# EAGLE design a917-stereo-split (EAGLE 7.6.0)
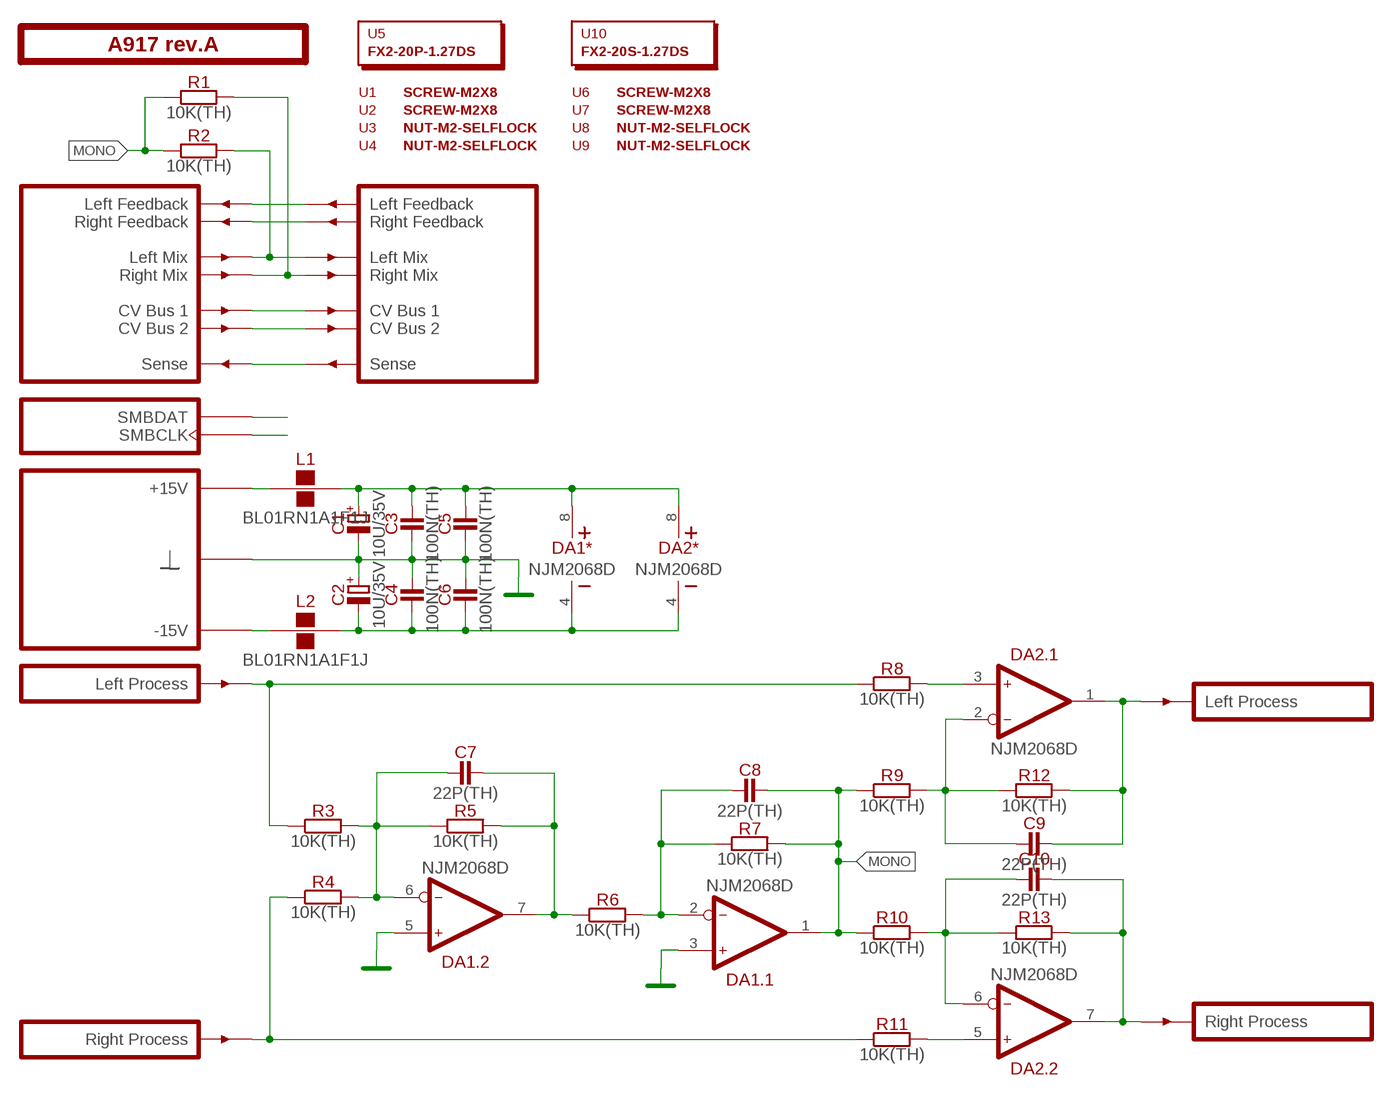
[diagram p0: schematic, sheet 1]

## Parts
C1  10U/35V  [E2-5]
C2  10U/35V  [E2-5]
C3  100N(TH)  [C050-024X044]
C4  100N(TH)  [C050-024X044]
C5  100N(TH)  [C050-024X044]
C6  100N(TH)  [C050-024X044]
C7  22P(TH)  [C050-024X044]
C8  22P(TH)  [C050-024X044]
C9  22P(TH)  [C050-024X044]
C10  22P(TH)  [C050-024X044]
DA1  NJM2068D  [DIP-8]
DA2  NJM2068D  [DIP-8]
L1  BL01RN1A1F1J  [BL01RN1A]
L2  BL01RN1A1F1J  [BL01RN1A]
PCB1  A917 rev.A  ST2-BOARD-26  [ST2-BOARD-26]
R1  10K(TH)  [R-0207/10]
R2  10K(TH)  [R-0207/10]
R3  10K(TH)  [R-0207/10]
R4  10K(TH)  [R-0207/10]
R5  10K(TH)  [R-0207/10]
R6  10K(TH)  [R-0207/10]
R7  10K(TH)  [R-0207/10]
R8  10K(TH)  [R-0207/10]
R9  10K(TH)  [R-0207/10]
R10  10K(TH)  [R-0207/10]
R11  10K(TH)  [R-0207/10]
R12  10K(TH)  [R-0207/10]
R13  10K(TH)  [R-0207/10]
U1  SCREW-M2X8  [EMPTY]
U2  SCREW-M2X8  [EMPTY]
U3  NUT-M2-SELFLOCK  [EMPTY]
U4  NUT-M2-SELFLOCK  [EMPTY]
U5  FX2-20P-1.27DS  [EMPTY]
U6  SCREW-M2X8  [EMPTY]
U7  SCREW-M2X8  [EMPTY]
U8  NUT-M2-SELFLOCK  [EMPTY]
U9  NUT-M2-SELFLOCK  [EMPTY]
U10  FX2-20S-1.27DS  [EMPTY]

## Nets
GND: C1.- C2.+ C3.1 C4.2 C5.1 C6.2 DA1.3(.1:IN+) DA1.5(.2:IN+) PCB1.B4'(GND) PCB1.B4(GND) PCB1.B5'(GND) PCB1.B5(GND) PCB1.B6'(GND) PCB1.B6(GND) PCB1.B7'(GND) PCB1.B7(GND) PCB1.B8'(GND) PCB1.B8(GND)
MONO: C8.2 DA1.1(.1:OUT) R1.1 R2.1 R7.2 R9.1 R10.1
N$1: PCB1.ALFBK'(LFBK') PCB1.ALFBK(LFBK)
N$2: PCB1.ARFBK'(RFBK') PCB1.ARFBK(RFBK)
N$3: PCB1.ALMIX'(LMIX') PCB1.ALMIX(LMIX) R2.2
N$4: PCB1.ARMIX'(RMIX') PCB1.ARMIX(RMIX) R1.2
N$5: PCB1.ACV1'(CV1') PCB1.ACV1(CV1)
N$6: PCB1.ACV2'(CV2') PCB1.ACV2(CV2)
N$7: PCB1.BSENSE'(SENSE') PCB1.BSENSE(SENSE)
N$8: PCB1.ASMBDAT'(SMBDAT) PCB1.ASMBDAT(SMBDAT)
N$9: PCB1.ASMBCLK'(SMBCLK) PCB1.ASMBCLK(SMBCLK)
N$10: C7.1 DA1.6(.2:IN-) R3.2 R4.2 R5.1
N$11: C7.2 DA1.7(.2:OUT) R5.2 R6.1
N$12: C8.1 DA1.2(.1:IN-) R6.2 R7.1
N$14: DA2.3(.1:IN+) R8.2
N$15: C9.1 DA2.2(.1:IN-) R9.2 R12.1
N$16: C9.2 DA2.1(.1:OUT) PCB1.BOUTL'(OUTL) R12.2
N$17: DA2.5(.2:IN+) R11.2
N$18: C10.1 DA2.6(.2:IN-) R10.2 R13.1
N$19: C10.2 DA2.7(.2:OUT) PCB1.BOUTR'(OUTR) R13.2
N$20: PCB1.BINL(INL) R3.1 R8.1
N$22: PCB1.BINR(INR) R4.1 R11.1
N$25: L1.1 PCB1.A+15'(P+15V) PCB1.A+15(P+15V) PCB1.B+15'(P+15V) PCB1.B+15(P+15V)
N$45: C1.+ C3.2 C5.2 DA1.8(*:V+) DA2.8(*:V+) L1.2
N$46: L2.1 PCB1.A-15'(P-15V) PCB1.A-15(P-15V) PCB1.B-15'(P-15V) PCB1.B-15(P-15V)
N$47: C2.- C4.1 C6.1 DA1.4(*:V-) DA2.4(*:V-) L2.2

## Library data of the parts
C1 C2 = capacitors-electrolytic:?; MOUSER: 647-USW1V100MDD
C3-C6 = capacitors:?; MOUSER: 81-RCER71H104K0A2H3B
C7-C10 = capacitors:?
DA1 DA2 = ic-jrc:NJM2068; MOUSER: 513-NJM2068D
L1 L2 = inductors:BL01RN1A?; MOUSER: 81-BL01RN1A1F1J
PCB1 = module-footprints:ST2-BOARD-?
R1-R13 = resistors:?; MOUSER: 71-RN55D-F-10K
U1-U4 U6-U9 = hardware:*?
U5 = hardware:?; MOUSER: 798-FX2-20P-1.27DS71
U10 = hardware:?; MOUSER: 798-FX2-20S-1.27DS71

## Board
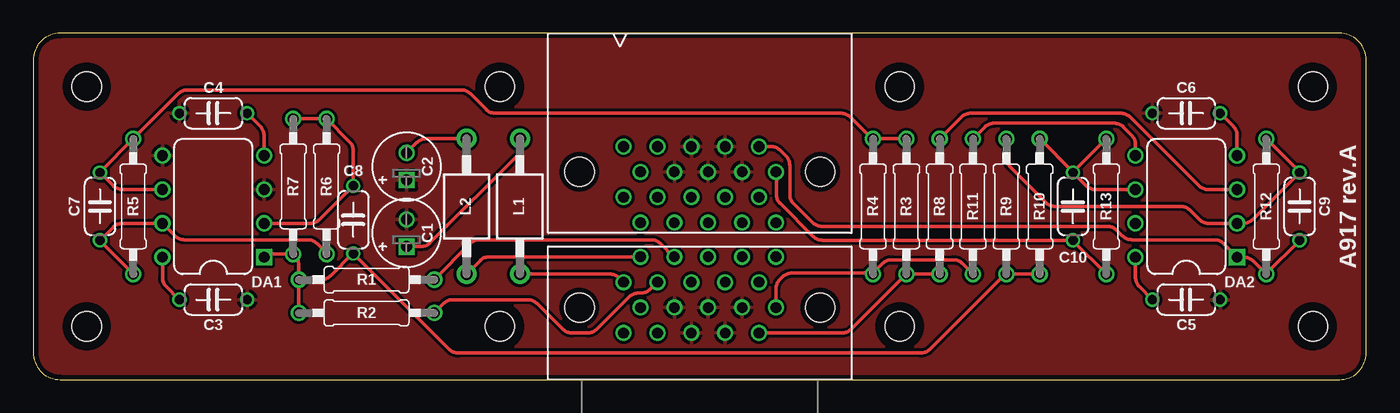
[diagram p1: board, top side]
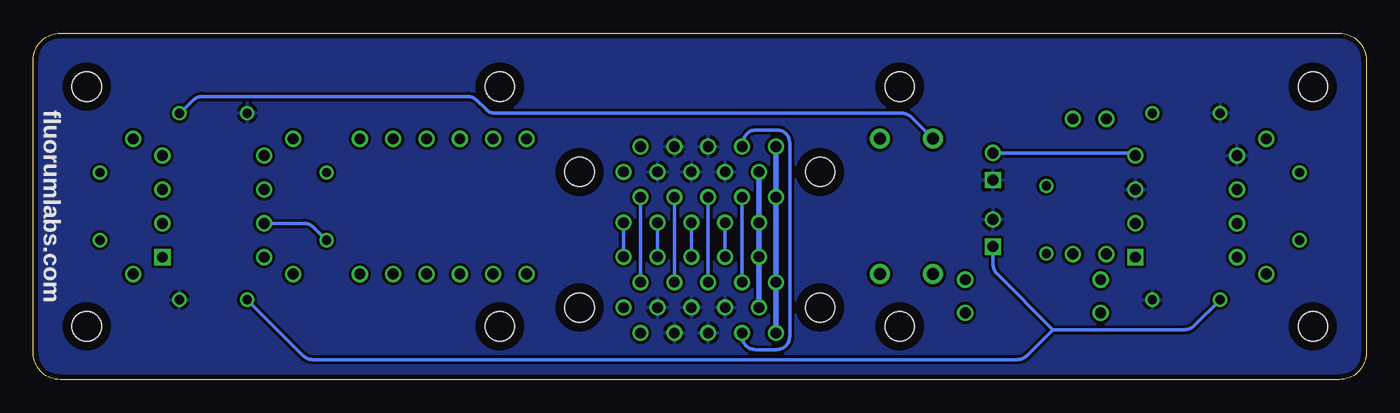
[diagram p2: board, bottom side, seen from below]

Size 100 x 26 mm. Coordinates in mm from the lower left corner, seen from the top.
Outline: 0,24 0,2 arc90 2,0 98,0 arc90 100,2 100,24 arc90 98,26 2,26 arc90 0,24
Copper layers (1*16): Top 0.0356mm / dielectric 1.5011mm / Bottom 0.0356mm
Design rules "sonictrain": minimum track width 6mil, minimum drill 13mil, track to track 8mil, track to pad 8mil, pad to pad 6mil, via to via 6mil, smd to smd 6mil, copper to edge 15mil, drill to drill 6mil, minimum pad ring 7mil, minimum via ring 7mil, stop-mask expansion 3mil, vias tented up to drill 25mil, thermal gap 10mil

### Footprints (pad centres in the part's own frame; a part is rotated, then mirrored left to right if it is on the bottom)
E2-5 = drill 0.813 square: + -1.016,0 | drill 0.813: - 1.016,0
C050-024X044 = drill 0.7: 1 -2.54,0; 2 2.54,0
DIP-8 = drill 0.813 square: 1 -3.81,-3.81 | drill 0.813: 2 -1.27,-3.81; 3 1.27,-3.81; 4 3.81,-3.81; 5 3.81,3.81; 6 1.27,3.81; 7 -1.27,3.81; 8 -3.81,3.81
BL01RN1A = drill 0.9 pad 1.5: 1 -5.08,0; 2 5.08,0
ST2-BOARD-26 = drill 0.8: A+15 44.285,7.31; A+15' 44.285,13.69; A-15 45.555,9.215; A-15' 45.555,11.785; ACV1 51.905,7.31; ACV1' 51.905,13.69; ACV2 53.175,9.215; ACV2' 53.175,11.785; ALFBK 49.365,7.31; ALFBK' 49.365,13.69; ALMIX 46.825,7.31; ALMIX' 46.825,13.69; ARFBK 50.635,9.215; ARFBK' 50.635,11.785; ARMIX 48.095,9.215; ARMIX' 48.095,11.785; ASMBCLK 55.715,9.215; ASMBCLK' 55.715,11.785; ASMBDAT 54.445,7.31; ASMBDAT' 54.445,13.69; B4 48.095,5.405; B4' 48.095,15.595; B5 49.365,3.5; B5' 49.365,17.5; B6 50.635,5.405; B6' 50.635,15.595; B7 51.905,3.5; B7' 51.905,17.5; B8 53.175,5.405; B8' 53.175,15.595; B+15 44.285,3.5; B+15' 44.285,17.5; B-15 45.555,5.405; B-15' 45.555,15.595; BINL 54.445,3.5; BINR 55.715,5.405; BOUTL' 54.445,17.5; BOUTR' 55.715,15.595; BSENSE 46.825,3.5; BSENSE' 46.825,17.5 | hole 2.2: 4,4; 4,22; 96,4; 96,22; 35,22; 65,22; 65,4; 35,4; 59.025,5.405; 40.975,5.405; 40.975,15.595; 59.025,15.595
R-0207/10 = drill 0.813: 1 -5.08,0; 2 5.08,0

### Placement (x,y rotation side)
C1  28,11 90 top
C2  28,16 90 top
C3  13.5,6 180 top
C4  13.5,20 180 top
C5  86.5,6 180 top
C6  86.5,20 180 top
C7  5,13 270 top
C8  24,12 270 top
C9  95,13 270 top
C10  78,13 270 top
DA1  13.5,13 90 top
DA2  86.5,13 90 top
L1  36.5,13 90 top
L2  32.5,13 90 top
PCB1  0,0 0 top
R1  25,7.5 0 top
R2  25,5 0 top
R3  65.5,13 90 top
R4  63,13 90 top
R5  7.5,13 270 top
R6  22,14.5 90 top
R7  19.5,14.5 270 top
R8  68,13 90 top
R9  73,13 90 top
R10  75.5,13 90 top
R11  70.5,13 90 top
R12  92.5,13 270 top
R13  80.5,13 270 top
U1  28,-59 0 top  (outside the outline)
U2  31,-59 0 top  (outside the outline)
U3  34,-59 0 top  (outside the outline)
U4  37,-59 0 top  (outside the outline)
U5  40,-59 0 top  (outside the outline)
U6  43,-59 0 top  (outside the outline)
U7  46,-59 0 top  (outside the outline)
U8  49,-59 0 top  (outside the outline)
U9  52,-59 0 top  (outside the outline)
U10  55,-59 0 top  (outside the outline)

### Tracks (layer width: path | path; a pad name or v marks a point on that pad's centre or on a via)
GND
  pour Top: 0,26 100,26 100,0 0,0
  pour Bottom: 0,26 100,26 100,0 0,0
MONO
  Top 0.254: R10.1 R9.1 72.92,7.92 67.29,2.29 arc-45 66.59,2 31.87,2 arc-45 31.17,2.29 C8.2 23.96,9.46 22.29,7.79 arc-45 21.59,7.5 R1.1 | DA1.1 arc-45 17.86,9.42 R7.2 19.63,9.29 arc-45 19.92,8.59 R1.1 | R2.1 R1.1
N$1
  Bottom 0.254: PCB1.ALFBK' PCB1.ALFBK
N$2
  Bottom 0.254: PCB1.ARFBK' PCB1.ARFBK
N$3
  Top 0.254: PCB1.ALMIX 46.81,7.31 46.29,6.79 arc-45 45.59,6.5 45.41,6.5 arc45 44.71,6.21 42.29,3.79 arc-45 41.59,3.5 40.41,3.5 arc-45 39.71,3.79 37.79,5.71 arc45 37.09,6 31.49,6 arc45 30.79,5.71 R2.2
  Bottom 0.254: PCB1.ALMIX PCB1.ALMIX'
N$4
  Top 0.254: PCB1.ARMIX 48.03,9.21 47.04,10.21 arc45 46.34,10.5 33.49,10.5 arc45 32.79,10.21 R1.2
  Bottom 0.254: PCB1.ARMIX' PCB1.ARMIX
N$5
  Bottom 0.254: PCB1.ACV1' PCB1.ACV1
N$6
  Bottom 0.254: PCB1.ACV2' PCB1.ACV2
N$7
  Bottom 0.254: PCB1.BSENSE 46.83,3.25 arc-90 45.83,2.25 44.25,2.25 arc-90 43.25,3.25 43.25,17.75 arc-90 44.25,18.75 45.75,18.75 arc-90 46.75,17.75 46.75,17.57 PCB1.BSENSE'
N$8
  Bottom 0.254: PCB1.ASMBDAT' PCB1.ASMBDAT
N$9
  Bottom 0.254: PCB1.ASMBCLK PCB1.ASMBCLK'
N$10
  Top 0.254: R3.2 R4.2 62.92,18.08 61.29,19.71 arc45 60.59,20 34.66,20 arc-45 33.96,20.29 32.79,21.46 arc45 32.09,21.75 11.58,21.75 arc45 10.88,21.46 R5.1 5,15.58 C7.1 5.98,14.56 arc45 6.68,14.27 DA1.6
N$11
  Top 0.254: R5.2 5,10.42 C7.2 5.98,11.44 arc-45 6.68,11.73 DA1.7 10.63,10.79 arc45 11.33,10.5 20.59,10.5 arc-45 21.29,10.21 22,9.5 R6.1
N$12
  Top 0.254: R7.1 R6.2 23.71,17.87 arc-45 24,17.17 C8.1 21.48,12.02 arc-45 20.78,11.73 DA1.2
N$14
  Top 0.254: DA2.3 88.14,14.27 arc-45 87.44,14.56 82.29,19.71 arc45 81.59,20 70.33,20 arc45 69.63,19.71 R8.2
N$15
  Top 0.254: R12.1 95,15.58 C9.1 91.48,12.02 arc-45 90.78,11.73 DA2.2 88.18,11.73 arc-45 87.48,12.02 86.79,12.71 arc45 86.09,13 76.66,13 arc-45 75.96,13.29 73.29,15.96 arc-45 73,16.66 R9.2
N$16
  Top 0.254: C9.2 92.5,7.96 R12.2 91.52,8.9 arc45 90.82,9.19 DA2.1 89.29,10.21 arc45 88.59,10.5 82.41,10.5 arc-45 81.71,10.79 81.29,11.21 arc45 80.59,11.5 59.16,11.5 arc-45 58.46,11.79 57.04,13.21 arc-45 56.75,13.91 56.75,16.09 arc45 56.46,16.79 56.04,17.21 arc45 55.34,17.5 PCB1.BOUTL'
N$17
  Top 0.254: DA2.5 82.69,17.65 arc45 82.4,18.35 81.79,18.96 arc45 81.09,19.25 72.08,19.25 arc45 71.38,18.96 R11.2
N$18
  Top 0.254: DA2.6 79.68,14.27 arc-45 78.98,14.56 C10.1 78,15.58 | 78,15.58 R13.1 | 78,15.58 R10.2
N$19
  Top 0.254: R13.2 78,10.42 C10.2 59.2,10.46 arc-45 58.5,10.75 56.04,13.21 arc-45 55.75,13.91 55.75,15.56 PCB1.BOUTR'
  Bottom 0.254: DA2.7 79.68,11.73 arc45 78.98,11.44 C10.2
N$20
  Top 0.254: R8.1 R3.1 61.37,3.79 arc-45 60.67,3.5 PCB1.BINL
N$22
  Top 0.254: R11.1 69.71,8.71 arc45 69.01,9 64.41,9 arc45 63.71,8.71 63,8 R4.1 62.92,8 56.91,8 arc45 56.21,7.71 56.01,7.51 arc45 55.72,6.8 PCB1.BINR
N$25
  Top 0.254: L1.1 43.26,7.92 arc-45 43.97,7.63 PCB1.A+15
  Bottom 0.406: PCB1.B+15 PCB1.A+15 PCB1.A+15' PCB1.B+15'
N$45
  Top 0.254: DA2.8 82.69,7.68 arc45 82.98,6.98 C5.2 | DA1.8 9.69,7.68 arc45 9.98,6.98 C3.2 | C1.+ 29.07,9.98 arc45 29.78,10.28 36.5,17 L1.2
  Bottom 0.254: C1.+ 28,8.66 arc-45 27.71,7.96 23.5,3.75 | 23.5,3.75 13.62,3.75 arc-45 12.92,4.04 C3.2 | 23.5,3.75 25.46,1.79 arc45 26.16,1.5 79.05,1.5 arc45 79.75,1.79 C5.2
N$46
  Top 0.254: PCB1.A-15 34.21,9.21 arc45 33.5,8.92 L2.1
  Bottom 0.406: PCB1.B-15' PCB1.A-15' PCB1.A-15 PCB1.B-15
N$47
  Top 0.254: DA2.4 90.31,18.32 arc45 90.02,19.02 C6.1 | DA1.4 17.31,18.32 arc45 17.02,19.02 C4.1 | L2.2 29.48,18.08 arc45 28.77,17.79 C2.-
  Bottom 0.254: C2.- 17.52,17.02 DA1.4 | C6.1 89,20 88.04,20.96 arc45 87.34,21.25 67.41,21.25 arc45 66.71,20.96 66.04,20.29 arc-45 65.34,20 34.83,20 arc45 34.13,19.71 L2.2